# EAGLE design trafficlight (EAGLE 9.6.2)
PROJECT_AUTHOR: XOSE PEREZ <xose.perez@gmail.com>; PROJECT_LICENSE: CC-BY-SA 4.0; PROJECT_NAME: TRAFFIC LIGHT; PROJECT_VERSION: 0.2.20180930
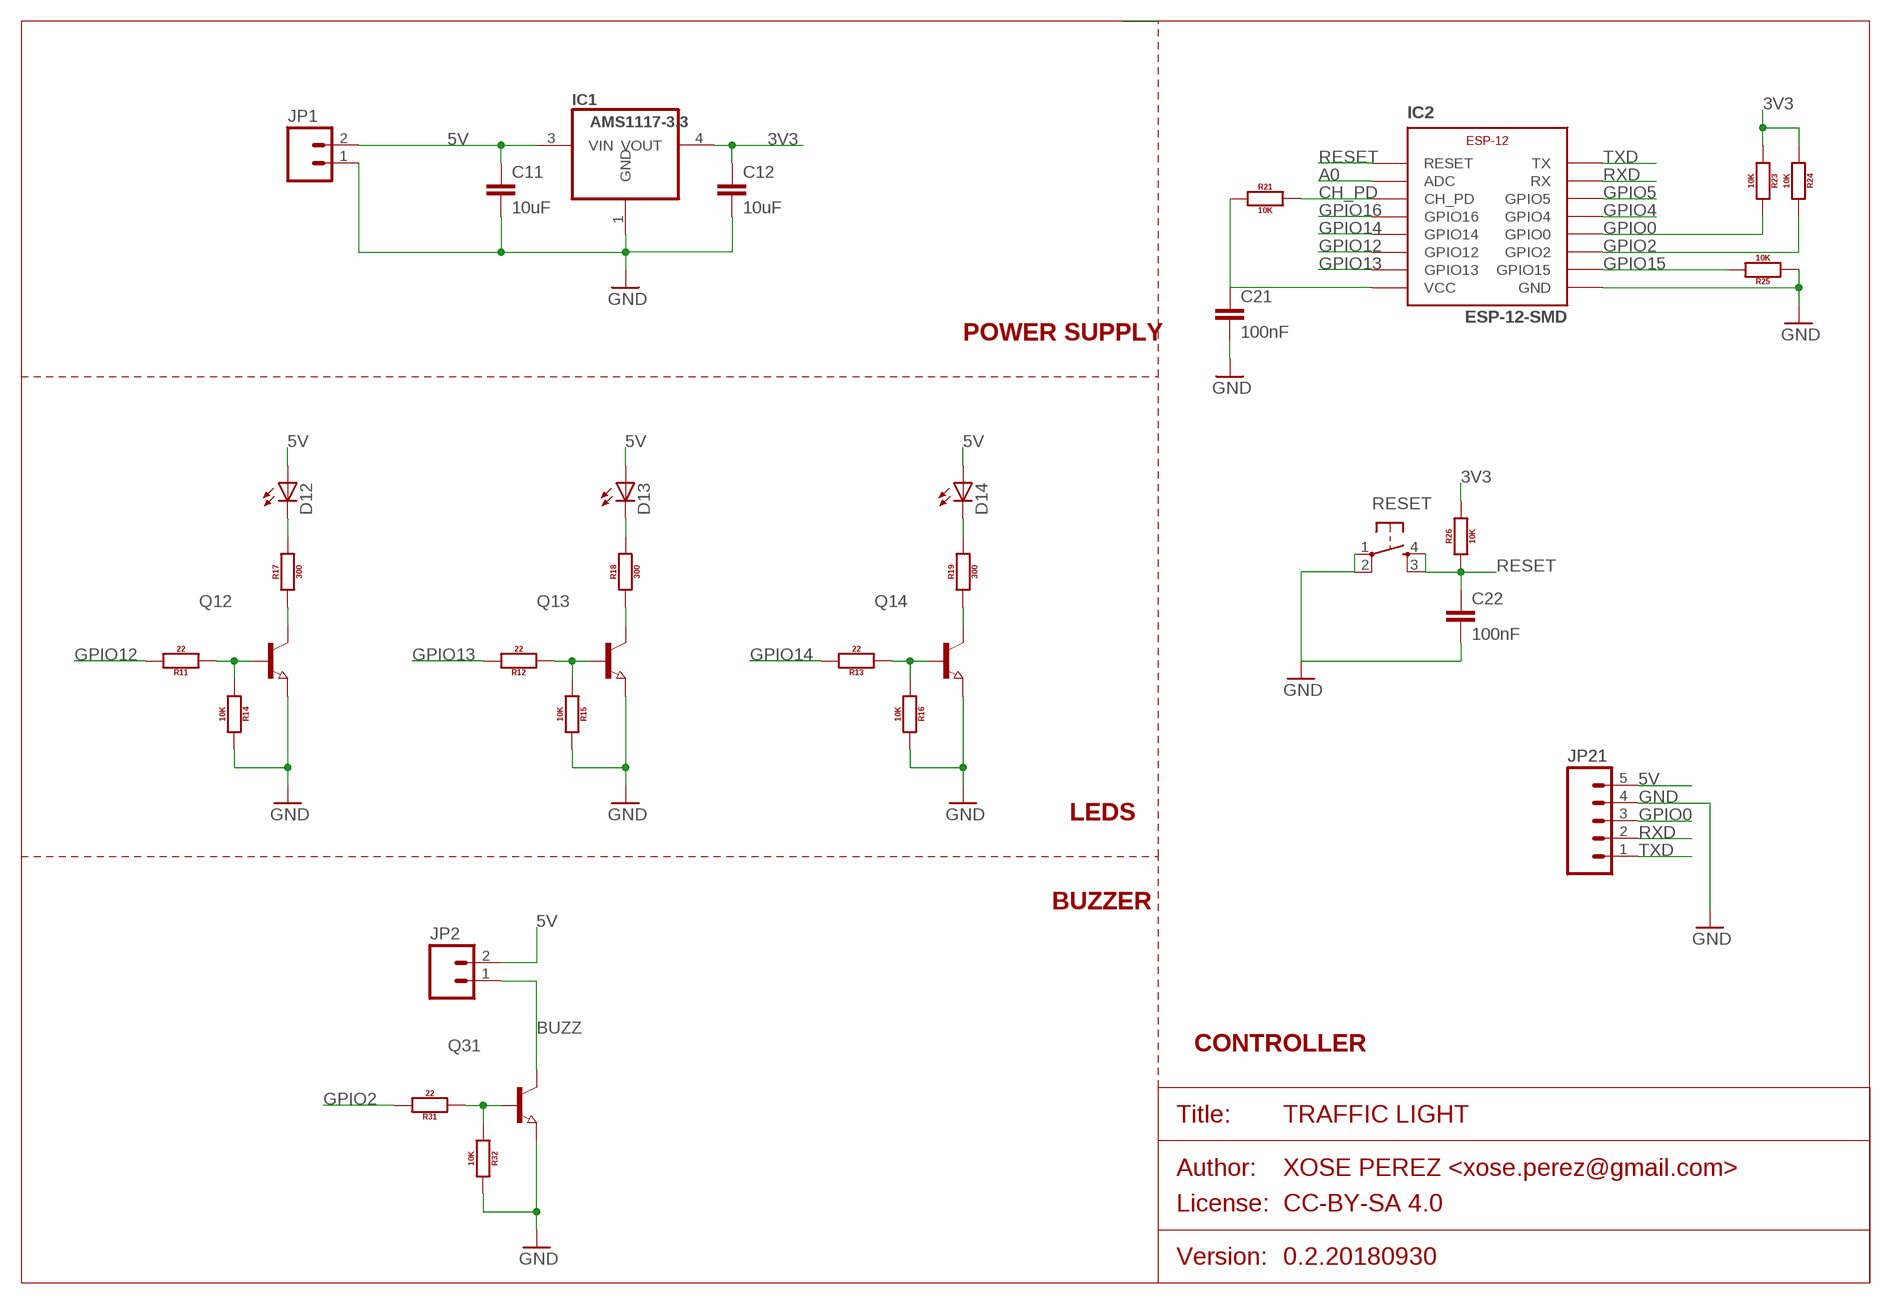
[diagram p0: schematic, sheet 1]

## Parts
C11  10uF  C-EU0805  [0805]
C12  10uF  C-EU0805  [0805]
C21  100nF  C-EU0805  [0805]
C22  100nF  C-EU0805  [0805]
D12  LED5MM  [LED5MM]
D13  LED5MM  [LED5MM]
D14  LED5MM  [LED5MM]
IC1  AMS1117-3.3  REG1117SOT223-2  [SOT223]
IC2  ESP-12-SMD  [ESP-12-SMD]
JP1  M02PTH  [1X02]
JP2  M02PTH  [1X02]
JP21  M05PTH  [1X05]
Q12  NPN-TRANSISTOR_SOT23  [SOT23]
Q13  NPN-TRANSISTOR_SOT23  [SOT23]
Q14  NPN-TRANSISTOR_SOT23  [SOT23]
Q31  NPN-TRANSISTOR_SOT23  [SOT23]
R11  22  RESISTOR0805  [0805]
R12  22  RESISTOR0805  [0805]
R13  22  RESISTOR0805  [0805]
R14  10K  RESISTOR0805  [0805]
R15  10K  RESISTOR0805  [0805]
R16  10K  RESISTOR0805  [0805]
R17  300  RESISTOR0805  [0805]
R18  300  RESISTOR0805  [0805]
R19  300  RESISTOR0805  [0805]
R21  10K  RESISTOR0805  [0805]
R23  10K  RESISTOR0805  [0805]
R24  10K  RESISTOR0805  [0805]
R25  10K  RESISTOR0805  [0805]
R26  10K  RESISTOR0805  [0805]
R31  22  RESISTOR0805  [0805]
R32  10K  RESISTOR0805  [0805]
RESET  TACTILE_BUTTON_SMD  [TACTILE-BUTTON-SMD]

## Nets
3V3: C12.1 C21.1 IC1.4(VOUT) IC2.VCC R21.1 R23.1 R24.1 R26.2
5V: C11.1 D12.A D13.A D14.A IC1.3(VIN) JP1.2 JP2.2 JP21.5
A0: IC2.ADC
BUZZ: JP2.1 Q31.3(C)
CH_PD: IC2.CH_PD R21.2
GND: C11.2 C12.2 C21.2 C22.2 IC1.1(GND) IC2.GND JP1.1 JP21.4 Q12.2(E) Q13.2(E) Q14.2(E) Q31.2(E) R14.2 R15.2 R16.2 R25.1 R32.2 RESET.1(SWA1) RESET.2(SWB1)
GPIO0: IC2.GPIO0 JP21.3 R23.2
GPIO2: IC2.GPIO2 R24.2 R31.2
GPIO4: IC2.GPIO4
GPIO5: IC2.GPIO5
GPIO12: IC2.GPIO12 R11.2
GPIO13: IC2.GPIO13 R12.2
GPIO14: IC2.GPIO14 R13.2
GPIO15: IC2.GPIO15 R25.2
GPIO16: IC2.GPIO16
N$1: Q13.1(B) R12.1 R15.1
N$2: D13.K(C) R18.2
N$3: Q12.1(B) R11.1 R14.1
N$4: Q13.3(C) R18.1
N$5: Q14.1(B) R13.1 R16.1
N$6: D14.K(C) R19.2
N$7: Q14.3(C) R19.1
N$8: D12.K(C) R17.2
N$10: Q12.3(C) R17.1
N$11: Q31.1(B) R31.1 R32.1
RESET: C22.1 IC2.RESET R26.1 RESET.3(SWB2) RESET.4(SWA2)
RXD: IC2.RX JP21.2
TXD: IC2.TX JP21.1

## Notes on the sheet
- POWER SUPPLY
- LEDS
- BUZZER
- CONTROLLER

## Library data of the parts
C11 C12 C21 C22 = xose:C-EU: CAPACITOR, European symbol
D12-D14 = adafruit:LED: LED OSRAM: - CHIPLED LG R971, LG N971, LY N971, LG Q971, LY Q971, LO R971, LY R971 LH N974, LH R974 LS Q976, LO Q976, LY Q976 LO Q996 - Hyper CHIPLED LW Q18S LB Q993, LB Q99A, LB R99A - SideLED LS A670, LO A670, LY A670, LG A670, LP A670 LB A673, LV A673, LT A673, LW A673 LH A674 LY A675 LS A676, LA A676, LO A676, LY A676, LW A676 LS A679, LY A679, LG A679 - Hyper Micro SIDELED® LS Y876, LA Y876, LO Y876, LY Y876 LT Y87S - SmartLED LW L88C, LW L88S LB L89C, LB L89S, LG L890 LS L89K, LO L89K, LY L89K LS L896, LA L896, LO L896, LY L896 - TOPLED LS T670, LO T670, LY T670, LG T670, LP T670 LSG T670, LSP T670, LSY T670, LOP T670, LYG T670 LG T671, LOG T671, LSG T671 LB T673, LV T673, LT T673, LW T673 LH T674 LS T676, LA T676, LO T676, LY T676, LB T676, LH T676, LSB T676, LW T676 LB T67C, LV T67C, LT T67C, LS T67K, LO T67K, LY T67K, LW E67C LS E67B, LA E67B, LO E67B, LY E67B, LB E67C, LV E67C, LT E67C LW T67C LS T679, LY T679, LG T679 LS T770, LO T770, LY T770, LG T770, LP T770 LB T773, LV T773, LT T773, LW T773 LH T774 LS E675, LA E675, LY E675, LS T675 LS T776, LA T776, LO T776, LY T776, LB T776 LHGB T686 LT T68C, LB T68C - Hyper Mini TOPLED® LB M676 - Mini TOPLED Santana® LG M470 LS M47K, LO M47K, LY M47K Source: http://www.osram.convergy.de/
IC1 = xose:REG1117: 800mA and 1A Low Dropout (LDO) Positive Regulator 1.8V, 2.5V, 2.85V, 3.3V, 5V, and Adj
IC2 = xose:ESP-12
JP1 JP2 = xose:M02: Standard 2-pin 0.1" header. Use with - straight break away headers ( PRT-00116) - right angle break away headers (PRT-00553) - swiss pins (PRT-00743) - machine pins (PRT-00117) - female headers (PRT-00115) Molex polarized connector foot print use with: PRT-08233 with associated crimp pins and housings. 2.54_SCREWTERM for use with PRT-10571. 3.5mm Screw Terminal footprints for PRT-08084 5mm Screw Terminal footprints for use with PRT-08432
JP21 = xose:M05: Header 5 Standard 5-pin 0.1" header. Use with straight break away headers (SKU : PRT-00116), right angle break away headers (PRT-00553), swiss pins (PRT-00743), machine pins (PRT-00117), and female headers (PRT-00115). Molex polarized connector foot print use with SKU : PRT-08230 with associated crimp pins and housings.
Q12-Q14 Q31 = xose:NPN-TRANSISTOR_: NPN TRANSISTOR
R11-R19 R21 R23-R26 R31 R32 = xose:RESISTOR: Generic EU resistor symbol
RESET = xose:TACTILE_BUTTON: Tactile Button SparkFun Electronics' Tactile Button COM-10302

## Board
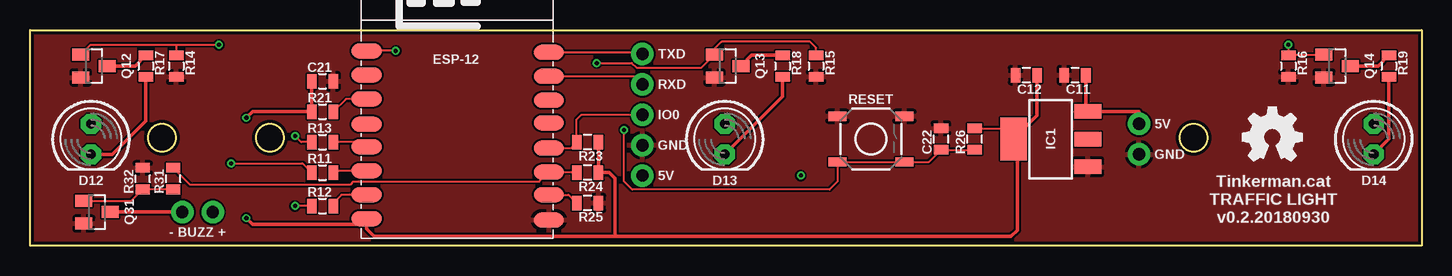
[diagram p1: board, top side]
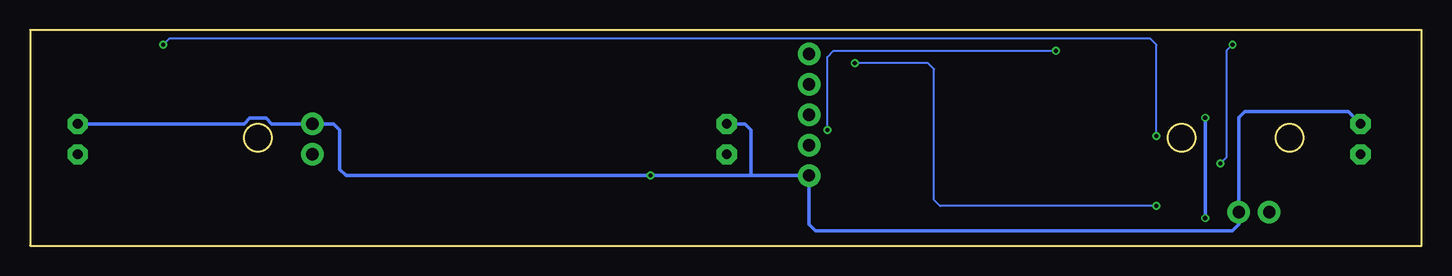
[diagram p2: board, bottom side, seen from below]

Size 116 x 18 mm. Coordinates in mm from the lower left corner, seen from the top.
Outline: 0,0 0,18 116,18 116,0 0,0
Outline: circle at 11,9 radius 1.14
Outline: circle at 97,9 radius 1.14
Outline: circle at 20,9 radius 1.14
Copper layers (1*16): Top 0.035mm / dielectric 1.5mm / Bottom 0.035mm
Design rules "seedstudio-2layer": minimum track width 6mil, minimum drill 12mil, track to track 6mil, track to pad 6mil, pad to pad 6mil, via to via 6mil, smd to smd 0mil, copper to edge 10mil, drill to drill 10mil, minimum pad ring 10mil, minimum via ring 6mil, stop-mask expansion 2mil, vias tented up to drill 100mil, thermal gap 10mil

### Footprints (pad centres in the part's own frame; a part is rotated, then mirrored left to right if it is on the bottom)
0805 = smd 0.8 x 1.2: 1 -0.9,0; 2 0.9,0
LED5MM = drill 0.813 pad 1.676 octagon: A -1.27,0; K 1.27,0
SOT223 = smd 1.219 x 2.235: 1 -2.311,-3.099; 2 0,-3.099; 3 2.311,-3.099 | smd 3.6 x 2.2: 4 0,3.099
ESP-12-SMD = smd 2.54 x 1.27: ADC -7,5.1; CH_PD -7,3.1; GND 8.2,-7; GPIO0 8.2,-1; GPIO2 8.2,-3; GPIO4 8.2,1.1; GPIO5 8.2,3; GPIO12 -7,-2.9; GPIO13 -7,-4.9; GPIO14 -7,-0.9; GPIO15 8.2,-4.9; GPIO16 -7,1; RESET -7,7.1; RX 8.2,5; TX 8.2,7; VCC -7,-6.9
1X02 = drill 1.016 pad 1.88: 1 0,0; 2 2.54,0
1X05 = drill 1.016 pad 1.88: 1 0,0; 2 2.54,0; 3 5.08,0; 4 7.62,0; 5 10.16,0
SOT23 = smd 1 x 1.4: 1 -0.95,-1.1; 2 0.95,-1.1; 3 0,1.1
TACTILE-BUTTON-SMD = smd 1.524 x 0.762: 1 -2.794,1.905; 2 2.794,1.905; 3 -2.794,-1.905; 4 2.794,-1.905

### Placement (x,y rotation side)
C11  87.12,14.22 180 top
C12  83.06,14.22 180 top
C21  24.38,13.72 0 top
C22  75.95,8.89 90 top
D12  5.08,8.89 270 top
D13  57.91,8.89 270 top
D14  112.01,8.89 270 top
IC1  85.09,8.89 90 top
IC2  35.05,9.14 0 top
JP1  92.46,7.62 90 top
JP2  12.7,2.79 0 top
JP21  51.05,16 270 top
Q12  5.33,14.99 270 top
Q13  58.17,14.99 270 top
Q14  108.97,14.99 270 top
Q31  5.59,2.79 270 top
R11  24.38,6.1 0 top
R12  24.38,3.3 0 top
R13  24.38,8.64 0 top
R14  12.19,14.99 270 top
R15  65.53,14.99 270 top
R16  104.9,14.99 270 top
R17  9.65,14.99 270 top
R18  62.74,14.99 270 top
R19  113.28,14.99 270 top
R21  24.38,11.18 0 top
R23  46.48,8.64 180 top
R24  46.48,6.1 180 top
R25  46.48,3.56 180 top
R26  78.74,8.89 90 top
R31  11.94,5.59 90 top
R32  9.4,5.59 90 top
RESET  70.1,8.89 0 top

### Tracks (layer width: path | path; a pad name or v marks a point on that pad's centre or on a via)
3V3  (via drill 0.35)
  Top 0.152: R26.2 81.09,9.79 IC1.4
  Top 0.305: C21.1 R21.1 18.54,11.18 v18.03,10.67 | C12.1 83.96,10.86 IC1.4 82.3,8.43 82.3,1.27 81.79,0.76 48.77,0.76 | R23.1 R24.1 48.26,6.1 48.77,5.59 48.77,0.76 | 48.77,0.76 28.7,0.76 28.05,1.41 28.05,1.78 | 28.05,1.78 IC2.VCC | v18.03,2.29 18.54,1.78 28.05,1.78
  Bottom 0.305: v18.03,10.67 v18.03,2.29
5V  (via drill 0.35)
  Top 0.305: 87.15,11.2 IC1.3 | IC1.3 88.02,11.37 C11.1 | 64.15,5.96 v64.26,5.84 | IC1.3 92.43,11.2 92.46,11.18 JP1.2
  Bottom 0.305: 55.88,5.84 JP21.5 51.05,1.78 50.52,1.25 15.77,1.25 15.24,1.78 JP2.2 15.24,10.67 14.73,11.18 6.1,11.18 D12.A | 55.88,5.84 v64.26,5.84 89.66,5.84 90.17,6.35 90.17,9.65 90.68,10.16 JP1.2 95.86,10.16 96.33,10.63 97.67,10.63 98.14,10.16 D14.A | 55.88,5.84 55.88,9.65 56.39,10.16 D13.A
BUZZ
  Top 0.305: JP2.1 Q31.3
CH_PD
  Top 0.152: IC2.CH_PD 26.35,12.24 R21.2
GND
  pour Top: -0.76,19.05 116.84,19.05 116.84,-1.02 -0.76,-1.02
GPIO0
  Top 0.152: IC2.GPIO0 45.09,8.14 R23.2 45.58,10.53 45.97,10.92 JP21.3
GPIO2
  Top 0.152: R24.2 45.53,6.14 IC2.GPIO2 42.44,5.33 26.92,5.33 26.67,5.08 13.35,5.08 R31.2
GPIO12
  Top 0.152: IC2.GPIO12 25.43,6.24 R11.2
GPIO13
  Top 0.152: IC2.GPIO13 25.97,4.24 25.28,3.56 R12.2
GPIO14
  Top 0.152: IC2.GPIO14 27.66,8.64 R13.2
GPIO15
  Top 0.152: IC2.GPIO15 44.89,4.24 R25.2
N$1  (via drill 0.35)
  Top 0.152: R15.1 65.53,16.51 65.02,17.02 57.66,17.02 57.07,16.43 Q13.1 55.96,14.83 50.57,14.83 50.16,15.24 v47.24,15.24 | R12.1 v22.1,3.3
  Bottom 0.152: v22.1,3.3 40.13,3.3 40.64,3.81 40.64,14.73 41.15,15.24 v47.24,15.24
N$2
  Top 0.305: D13.K 62.74,12.45 R18.2
N$3  (via drill 0.35)
  Top 0.152: Q12.1 4.25,15.94 5.08,16.76 12.19,16.76 | 12.19,16.76 v15.75,16.76 | v16.76,6.86 22.72,6.86 R11.1 | 12.19,16.76 R14.1
  Bottom 0.152: v15.75,16.76 16.26,16.26 16.26,7.37 v16.76,6.86
N$4
  Top 0.305: Q13.3 60.17,15.89 R18.1
N$5  (via drill 0.35)
  Top 0.152: Q14.1 107.82,15.89 R16.1 v104.9,16.76 | R13.1 22.61,8.64 v22.1,9.14
  Bottom 0.152: v22.1,9.14 22.1,16.76 22.61,17.27 104.39,17.27 v104.9,16.76
N$6
  Top 0.305: D14.K 113.28,8.89 R19.2
N$7
  Top 0.305: R19.1 112.38,14.99 Q14.3
N$8
  Top 0.305: R17.2 9.65,10.41 6.86,7.62 D12.K
N$10
  Top 0.305: Q12.3 8.75,14.99 R17.1
N$11
  Top 0.152: R31.1 R32.1 8.45,3.74 Q31.1
RESET  (via drill 0.35)
  Top 0.152: R26.1 C22.1 74.94,6.99 RESET.4 RESET.3 67.31,5.33 66.65,4.67 50.19,4.67 49.53,5.33 v49.53,9.65 | v30.48,16.26 28.06,16.26 IC2.RESET
  Bottom 0.152: v49.53,9.65 49.53,15.75 49.02,16.26 v30.48,16.26
RXD
  Top 0.152: IC2.RX 50.37,14.14 JP21.2
TXD
  Top 0.152: IC2.TX 50.91,16.14 JP21.1

### Text on the board
tNames: TXD | RXD | IO0 | 5V | GND | GND | 5V | Tinkerman.cat / TRAFFIC LIGHT / v0.2.20180930 | - BUZZ +